# EAGLE schematic crankshaft_angle (EAGLE 7.5.0)
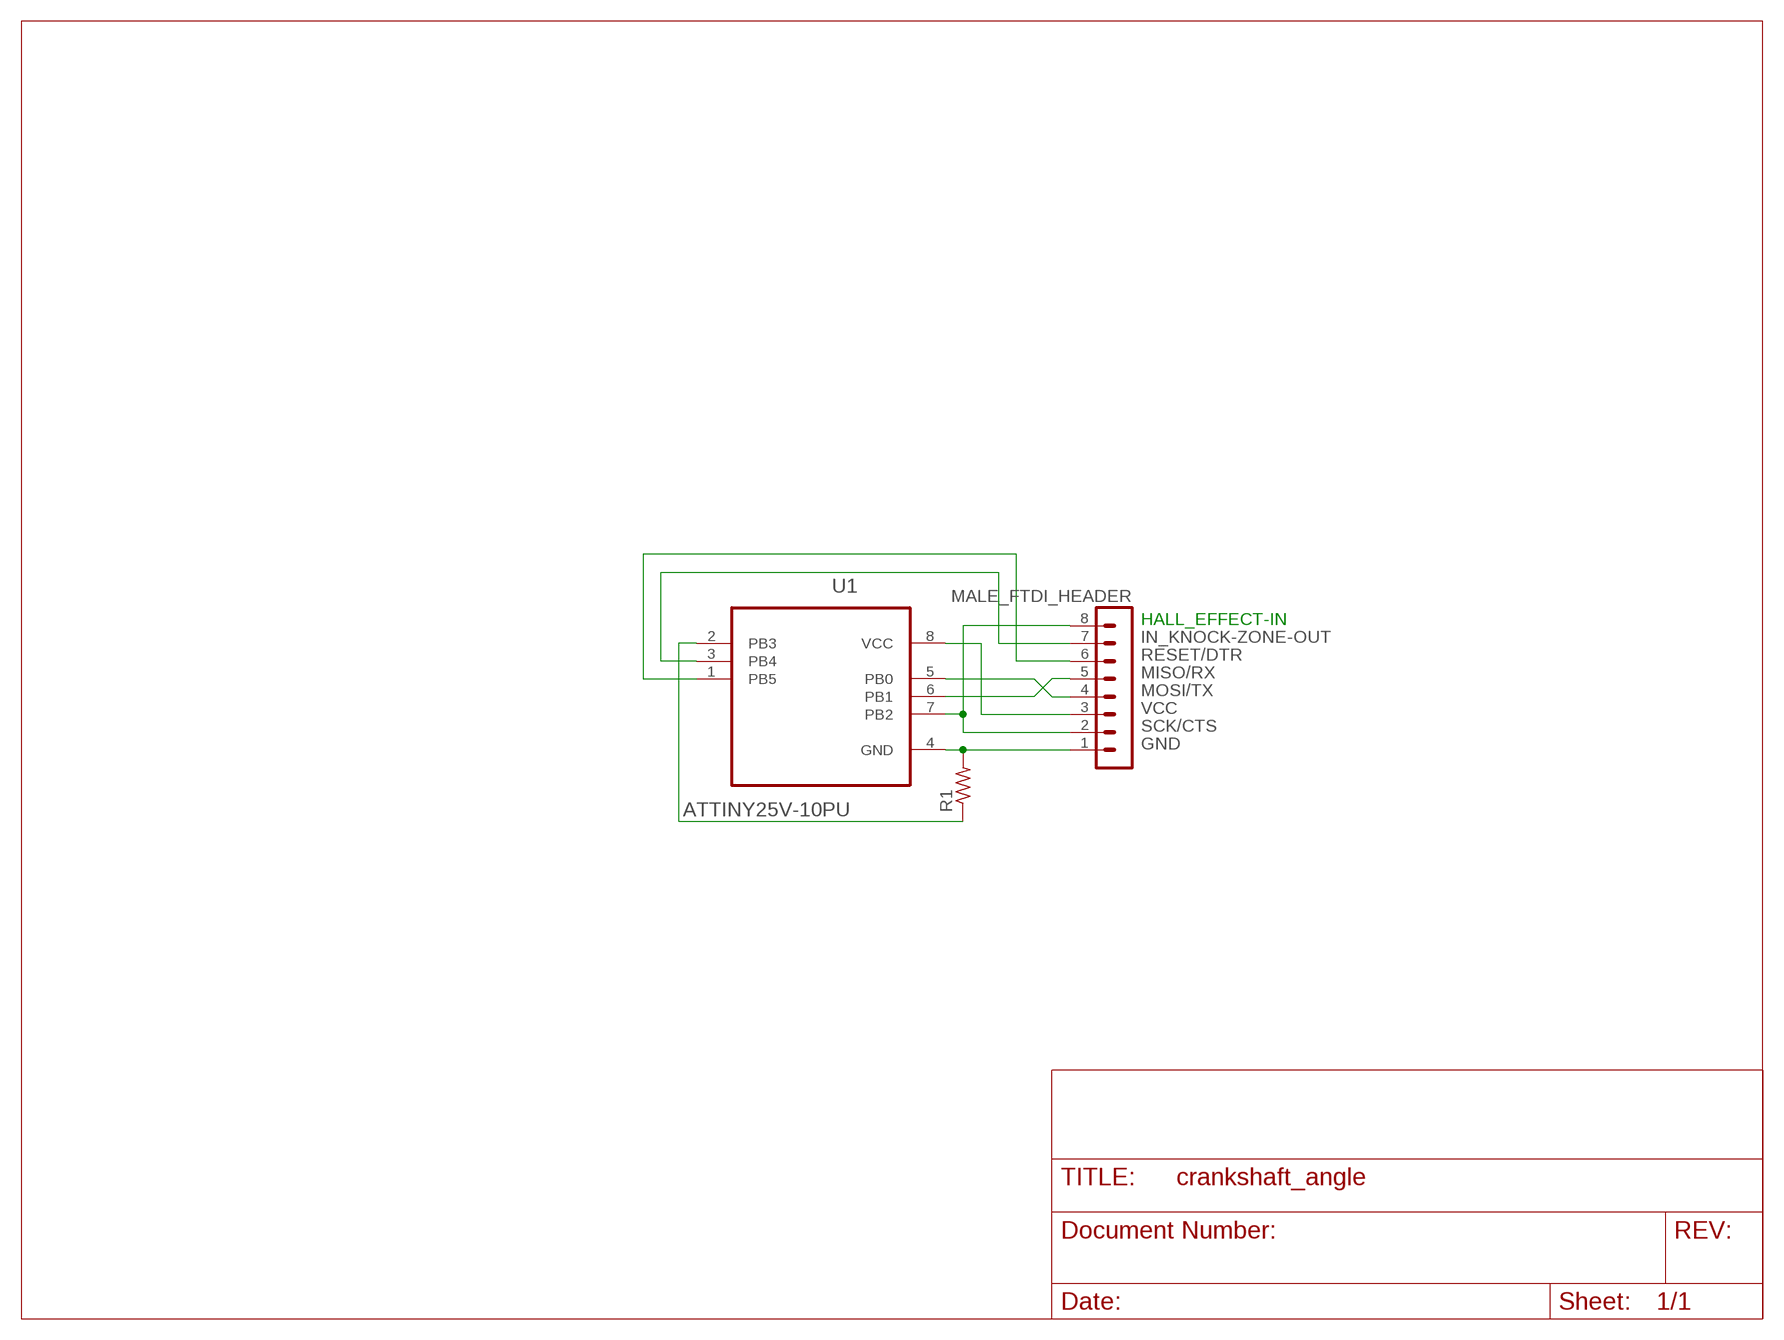
[diagram p0: schematic, sheet 1]

## Parts
MALE_FTDI_HEADER  MA08-1  [MA08-1]
R1  R-US_0204/7  [0204/7]
U1  ATTINY25V-10PU  [DIP254P762X533-8]

## Nets
GND: MALE_FTDI_HEADER.1 R1.2 U1.4(GND)
IN_KNOCK-ZONE-OUT: MALE_FTDI_HEADER.7 U1.3(PB4)
MISO/RX: MALE_FTDI_HEADER.5 U1.6(PB1)
MOSI/TX: MALE_FTDI_HEADER.4 U1.5(PB0)
N$1: R1.1 U1.2(PB3)
RESET/DTR: MALE_FTDI_HEADER.6 U1.1(PB5)
SCK/CTS: MALE_FTDI_HEADER.2 MALE_FTDI_HEADER.8 U1.7(PB2)
VCC: MALE_FTDI_HEADER.3 U1.8(VCC)

## Notes on the sheet
- HALL_EFFECT-IN

## Library data of the parts
MALE_FTDI_HEADER = con-lstb:MA08-1: PIN HEADER; OC_FARNELL: unknown; OC_NEWARK: unknown
R1 = rcl:R-US_: RESISTOR, American symbol
U1 = Atmel_By_element14_Batch_1-00:ATTINY25V-10PU: 8-bit Microcontroller with 2/4/8KBytes In-System Programmable Flash; MPN: ATTINY25V-10PU; OC_FARNELL: 1455144; OC_NEWARK: 58M3780; PACKAGE: PDIP-8; SUPPLIER: Atmel